# EAGLE schematic double (EAGLE 6.6.0)
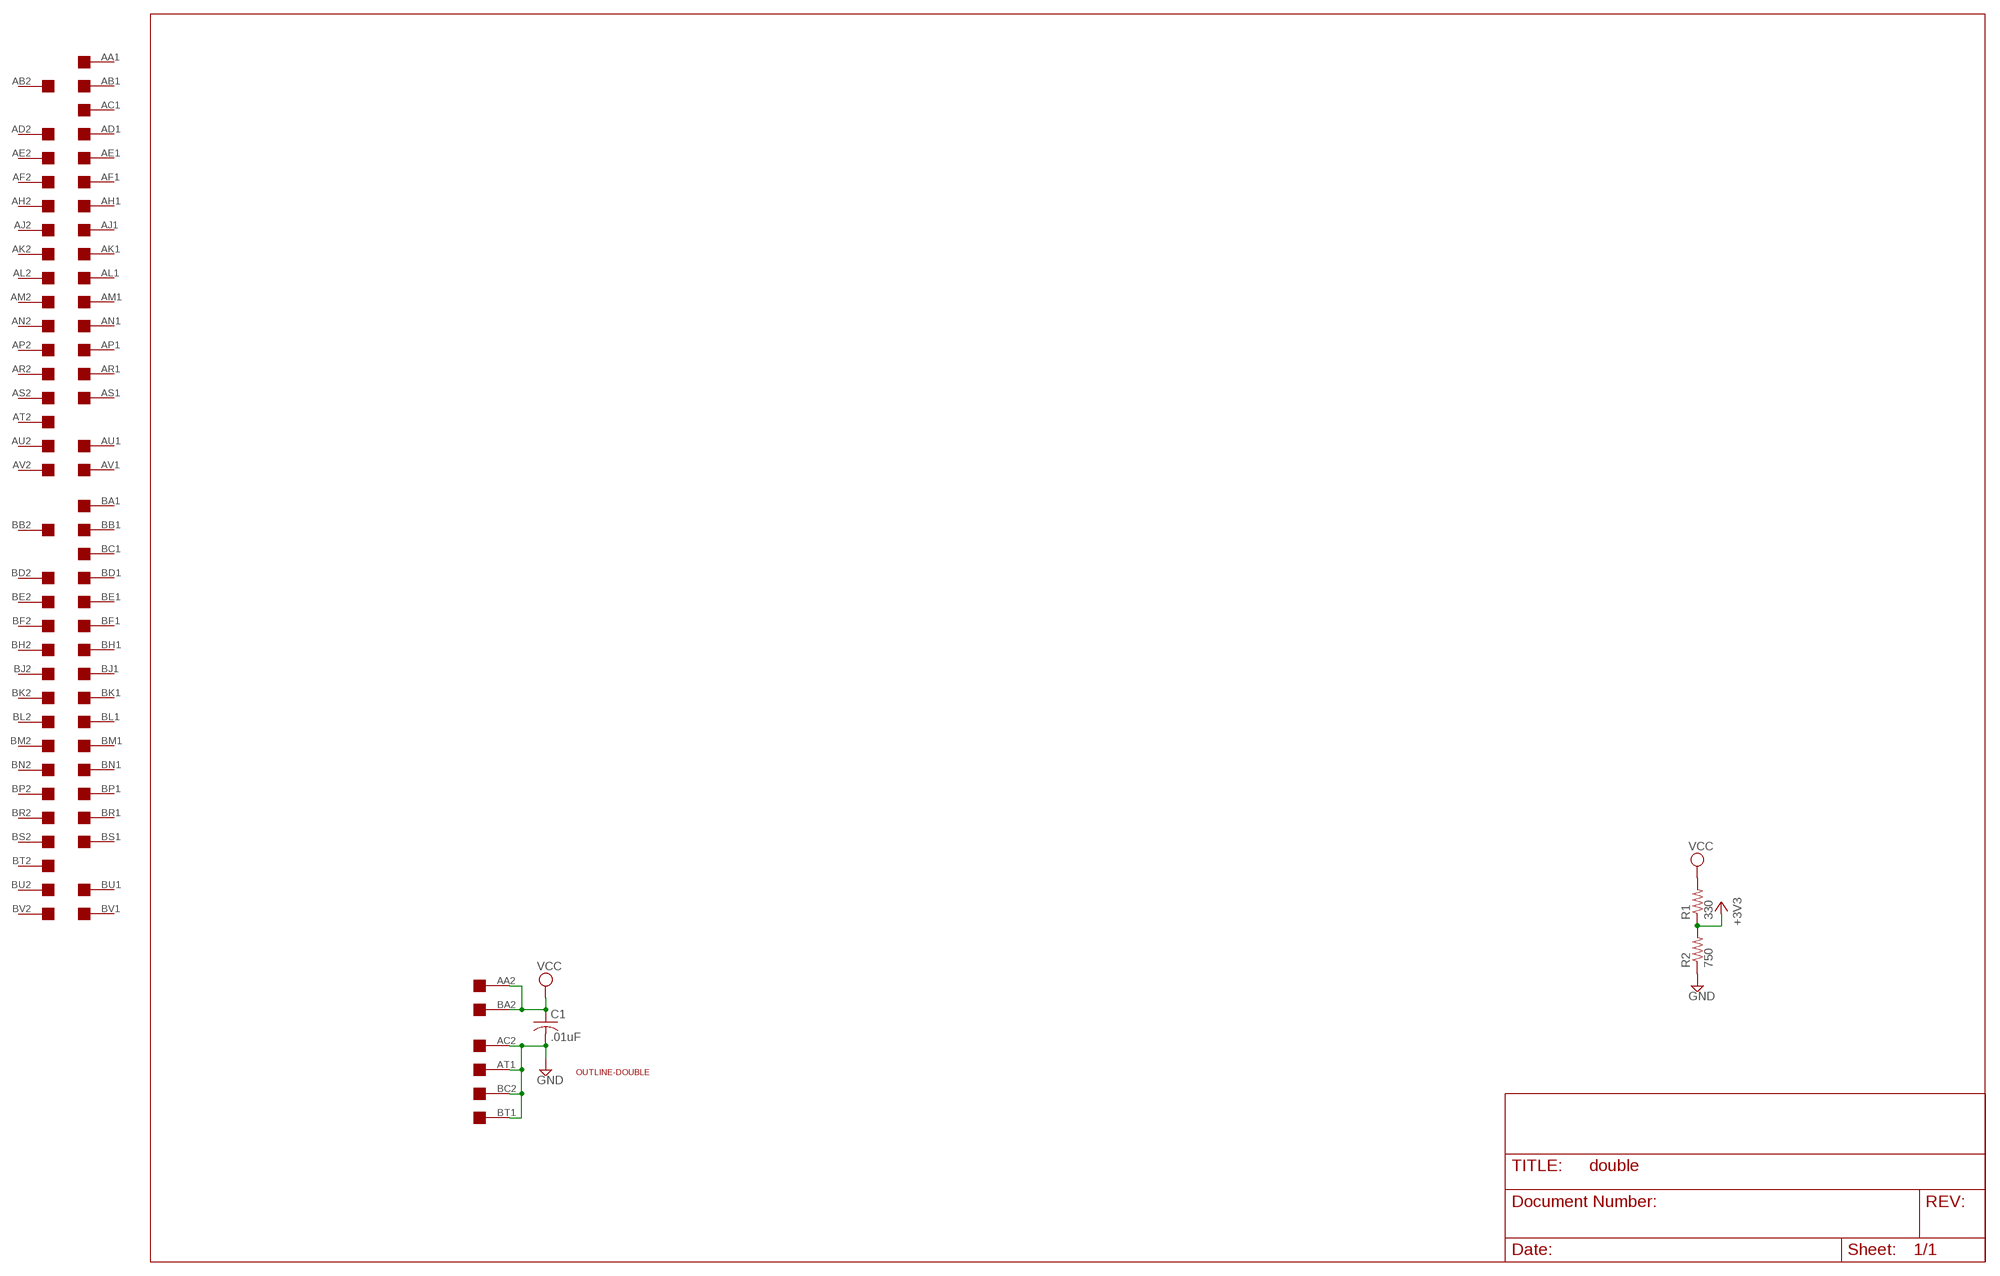
[diagram p0: schematic, sheet 1]

## Parts
C1  .01uF  C-US050-025X075  [C050-025X075]
R1  330  R-US_0207/10  [0207/10]
R2  750  R-US_0207/10  [0207/10]
U$1  OUTLINE-DOUBLE  [DOUBLE]
U$3  DOUBLE  [EDGE-CON4]

## Nets
+3V3: R1.1 R2.2
GND [supply]: C1.2 R2.1 U$3.AC2 U$3.AT1 U$3.BC2 U$3.BT1
VCC [supply]: C1.1 R1.2 U$3.AA2 U$3.BA2
Unconnected: U$3.AA1 U$3.AB1 U$3.AB2 U$3.AC1 U$3.AD1 U$3.AD2 U$3.AE1 U$3.AE2 U$3.AF1 U$3.AF2 U$3.AH1 U$3.AH2 U$3.AJ1 U$3.AJ2 U$3.AK1 U$3.AK2 U$3.AL1 U$3.AL2 U$3.AM1 U$3.AM2 U$3.AN1 U$3.AN2 U$3.AP1 U$3.AP2 U$3.AR1 U$3.AR2 U$3.AS1 U$3.AS2 U$3.AT2 U$3.AU1 U$3.AU2 U$3.AV1 U$3.AV2 U$3.BA1 U$3.BB1 U$3.BB2 U$3.BC1 U$3.BD1 U$3.BD2 U$3.BE1 U$3.BE2 U$3.BF1 U$3.BF2 U$3.BH1 U$3.BH2 U$3.BJ1 U$3.BJ2 U$3.BK1 U$3.BK2 U$3.BL1 U$3.BL2 U$3.BM1 U$3.BM2 U$3.BN1 U$3.BN2 U$3.BP1 U$3.BP2 U$3.BR1 U$3.BR2 U$3.BS1 U$3.BS2 U$3.BT2 U$3.BU1 U$3.BU2 U$3.BV1 U$3.BV2

## Library data of the parts
C1 = rcl:C-US: CAPACITOR, American symbol
R1 R2 = rcl:R-US_: RESISTOR, American symbol
U$1 = dec-con:OUTLINE-*: Board outlines for DEC boards.
U$3 = dec-con:DOUBLE: Double-Height DEC board

## Net classes
1 supply: width 0.813 mm